# EAGLE schematic armBandShield (EAGLE 9.3.0)
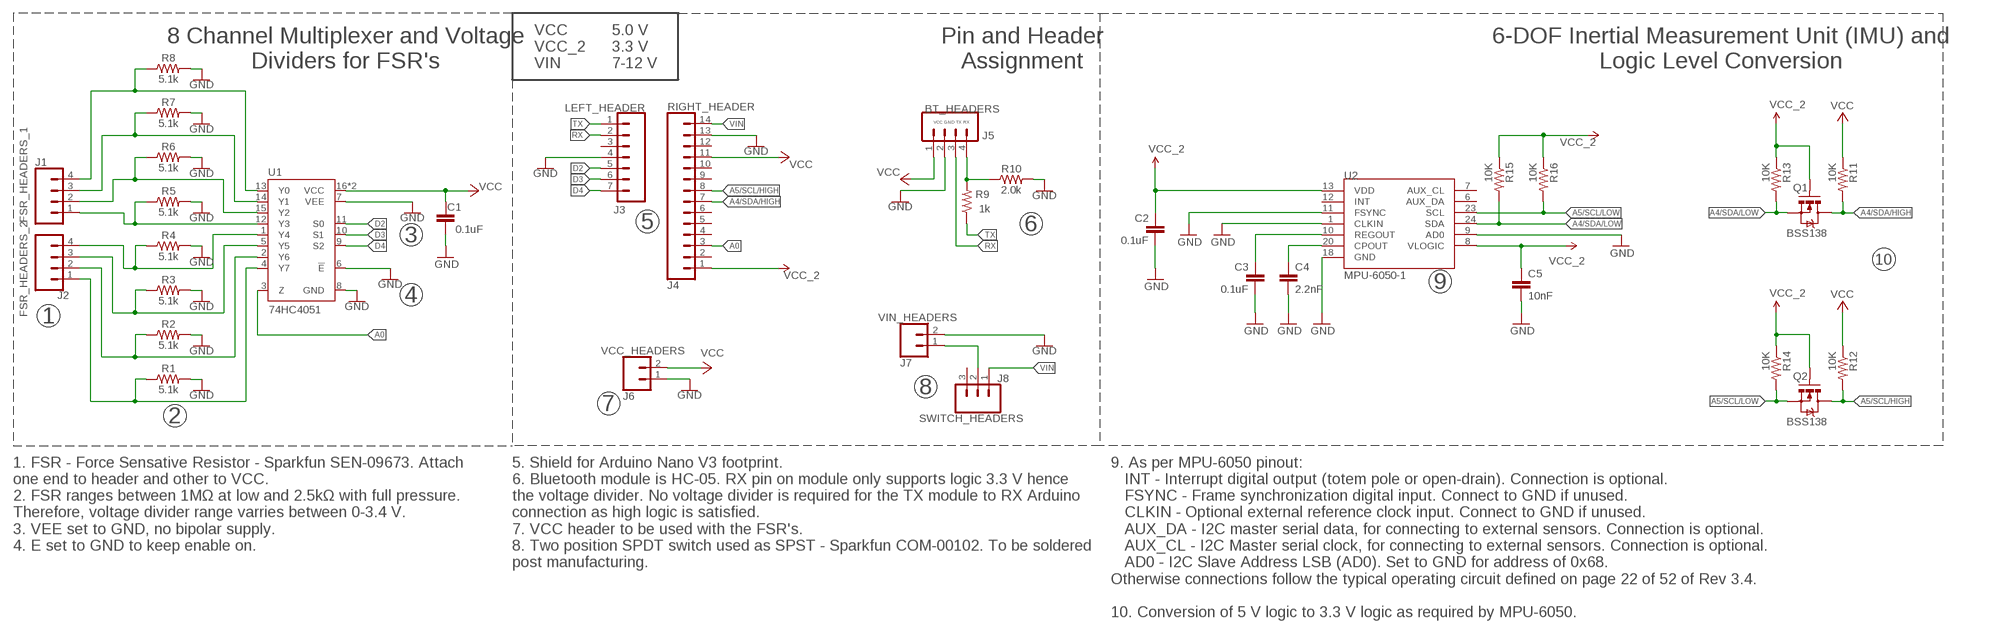
[diagram p0: schematic, sheet 1]

## Parts
74HC4051  U1  74HC4051BQ  [DHVQFN-16-2.5X3.5MM]
BT_HEADERS  J5  CONN_04  [1X04]
C1  0.1uF  0.1UF-25V(+80/-20%)(0603)  [0603-CAP]
C2  0.1uF  0.1UF-25V(+80/-20%)(0603)  [0603-CAP]
C3  0.1uF  0.1UF-25V(+80/-20%)(0603)  [0603-CAP]
C4  2.2nF  2.2NF/2200PF-0603-50V-10%  [0603]
C5  10nF  10NF-0603-50V-10%  [0603]
J1  FSR_HEADERS_1  CONN_04  [1X04]
J2  FSR_HEADERS_2  CONN_04  [1X04]
LEFT_HEADER  J3  CONN_07  [1X07]
Q1  BSS138  MOSFET-NCHANNELSMD  [SOT23-3]
Q2  BSS138  MOSFET-NCHANNELSMD  [SOT23-3]
R1  5.1k  5.1KOHM5.1KOHM-0603-1/10W-1%  [0603]
R2  5.1k  5.1KOHM5.1KOHM-0603-1/10W-1%  [0603]
R3  5.1k  5.1KOHM5.1KOHM-0603-1/10W-1%  [0603]
R4  5.1k  5.1KOHM5.1KOHM-0603-1/10W-1%  [0603]
R5  5.1k  5.1KOHM5.1KOHM-0603-1/10W-1%  [0603]
R6  5.1k  5.1KOHM5.1KOHM-0603-1/10W-1%  [0603]
R7  5.1k  5.1KOHM5.1KOHM-0603-1/10W-1%  [0603]
R8  5.1k  5.1KOHM5.1KOHM-0603-1/10W-1%  [0603]
R9  1k  1KOHM-0603-1/10W-1%  [0603]
R10  2.0k  2.0KOHM-0603-1/10W-5%  [0603]
R11  10K  RESISTOR0603-RES  [0603-RES]
R12  10K  RESISTOR0603-RES  [0603-RES]
R13  10K  RESISTOR0603-RES  [0603-RES]
R14  10K  RESISTOR0603-RES  [0603-RES]
R15  10K  10KOHM-1/10W-1%(0603)0603  [0603-RES]
R16  10K  10KOHM-1/10W-1%(0603)0603  [0603-RES]
RIGHT_HEADER  J4  CONN_14  [1X14]
SWITCH_HEADERS  J8  CONN_03  [1X03]
U2  MPU-6050-1  [QFN-24-4MM2]
VCC_HEADERS  J6  CONN_02PTH3  [1X02_LONGPADS]
VIN_HEADERS  J7  CONN_02PTH3  [1X02_LONGPADS]

## Nets
A0: 74HC4051.3(Z) RIGHT_HEADER.3
A4/SDA/HIGH: Q1.3(D) R11.2 RIGHT_HEADER.7
A4/SDA/LOW: Q1.2(S) R13.2 R15.2 U2.24(SDA)
A5/SCL/HIGH: Q2.3(D) R12.2 RIGHT_HEADER.8
A5/SCL/LOW: Q2.2(S) R14.2 R16.2 U2.23(SCL)
D2: 74HC4051.11(S0) LEFT_HEADER.5
D3: 74HC4051.10(S1) LEFT_HEADER.6
D4: 74HC4051.9(S2) LEFT_HEADER.7
FSR1: 74HC4051.4(Y7) J2.1 R1.1
FSR2: 74HC4051.2(Y6) J2.2 R2.1
FSR3: 74HC4051.5(Y5) J2.3 R3.1
FSR4: 74HC4051.1(Y4) J2.4 R4.1
FSR5: 74HC4051.12(Y3) J1.1 R5.1
FSR6: 74HC4051.15(Y2) J1.2 R6.1
FSR7: 74HC4051.14(Y1) J1.3 R7.1
FSR8: 74HC4051.13(Y0) J1.4 R8.1
GND [Pads]: 74HC4051.6(!E!) 74HC4051.7(VEE) 74HC4051.8(GND) BT_HEADERS.2 C1.2 C2.2 C3.2 C4.2 C5.2 LEFT_HEADER.4 R1.2 R2.2 R3.2 R4.2 R5.2 R6.2 R7.2 R8.2 R10.2 RIGHT_HEADER.13 U2.1(CLKIN) U2.9(AD0) U2.11(FSYNC) U2.18(GND) VCC_HEADERS.1 VIN_HEADERS.2
N$1: SWITCH_HEADERS.2 VIN_HEADERS.1
N$3: C4.1 U2.20(CPOUT)
N$5: C3.1 U2.10(REGOUT)
N$7: BT_HEADERS.4 R9.2 R10.1
RX: BT_HEADERS.3 LEFT_HEADER.2
TX: LEFT_HEADER.1 R9.1
VCC: 74HC4051.16(VCC) 74HC4051.EP(VCC) BT_HEADERS.1 C1.1 R11.1 R12.1 RIGHT_HEADER.11 VCC_HEADERS.2
VCC_2: C2.1 C5.1 Q1.1(G) Q2.1(G) R13.1 R14.1 R15.1 R16.1 RIGHT_HEADER.1 U2.8(VLOGIC) U2.13(VDD)
VIN: RIGHT_HEADER.14 SWITCH_HEADERS.1
Unconnected: LEFT_HEADER.3 RIGHT_HEADER.2 RIGHT_HEADER.4 RIGHT_HEADER.5 RIGHT_HEADER.6 RIGHT_HEADER.9 RIGHT_HEADER.10 RIGHT_HEADER.12 SWITCH_HEADERS.3 U2.6(AUX_DA) U2.7(AUX_CL) U2.12(INT)

## Notes on the sheet
- VCC
  VCC_2
  VIN
- 5.0 V
  3.3 V
  7-12 V
- 8 Channel Multiplexer and Voltage
  Dividers for FSR's
- Pin and Header
  Assignment
- 6-DOF Inertial Measurement Unit (IMU) and
  Logic Level Conversion
- VCC GND TX RX
- 5 | 6
- 3
- 10
- 9
- 4
- 1
- 8
- 7
- 2
- 1. FSR - Force Sensative Resistor - Sparkfun SEN-09673. Attach 
  one end to header and other to VCC.
  2. FSR ranges between 1MΩ at low and 2.5kΩ with full pressure. 
  Therefore, voltage divider range varries between 0-3.4 V. 
  3. VEE set to GND, no bipolar supply. 
  4. E set to GND to keep enable on.
- 5. Shield for Arduino Nano V3 footprint.
  6. Bluetooth module is HC-05. RX pin on module only supports logic 3.3 V hence 
  the voltage divider. No voltage divider is required for the TX module to RX Arduino
  connection as high logic is satisfied. 
  7. VCC header to be used with the FSR's.
  8. Two position SPDT switch used as SPST - Sparkfun COM-00102. To be soldered
  post manufacturing.
- 9. As per MPU-6050 pinout:
     INT - Interrupt digital output (totem pole or open-drain). Connection is optional.
     FSYNC - Frame synchronization digital input. Connect to GND if unused.
     CLKIN - Optional external reference clock input. Connect to GND if unused.
     AUX_DA - I2C master serial data, for connecting to external sensors. Connection is optional.
     AUX_CL - I2C Master serial clock, for connecting to external sensors. Connection is optional.
     AD0 - I2C Slave Address LSB (AD0). Set to GND for address of 0x68.
  Otherwise connections follow the typical operating circuit defined on page 22 of 52 of Rev 3.4.
  
  10. Conversion of 5 V logic to 3.3 V logic as required by MPU-6050.

## Library data of the parts
74HC4051 = SparkFun-IC-Logic:74*4051: NXP 74HC4051 8-Channel Analog Multiplexer/Demultiplexer The 74HC4051; 74HCT4051 is a single-pole octal-throw analog switch (SP8T) suitable for use in analog or digital 8:1 multiplexer/demultiplexer applications. The switch features three digital select inputs (S0, S1 and S2), eight independent inputs/outputs (Yn), a common input/output (Z) and a digital enable input (E). When E is HIGH, the switches are turned off. Inputs include clamp diodes. This enables the use of current limiting resistors to interface inputs to voltages in excess of VCC. Datasheet <http://www.nxp.com/documents/data_sheet/74HC_HCT4051.pdf>; PROD_ID: IC-13334
BT_HEADERS J1 J2 = SparkFun-Connectors:CONN_04: Multi connection point. Often used as Generic Header-pin footprint for 0.1 inch spaced/style header connections On any of the 0.1 inch spaced packages, you can populate with these: Break Away Headers - Straight <https://www.sparkfun.com/products/116> (PRT-00116) Break Away Male Headers - Right Angle <https://www.sparkfun.com/products/553> (PRT-00553) Female Headers <https://www.sparkfun.com/products/115> (PRT-00115) Break Away Headers - Machine Pin <https://www.sparkfun.com/products/117> (PRT-00117) Break Away Female Headers - Swiss Machine Pin <https://www.sparkfun.com/products/743> (PRT-00743) For SCREWTERMINALS and SPRING TERMINALS visit here: Screw Terimnals on SparkFun.com <https://www.sparkfun.com/search/results?term=Screw+Terminals> (5mm/3.5mm/2.54mm spacing) This device is also useful as a general connection point to wire up your design to another part of your project. Our various solder wires solder well into these plated through hole pads. Hook-Up Wire - Assortment (Stranded, 22 AWG) <https://www.sparkfun.com/products/11375> (PRT-11375) Hook-Up Wire - Assortment (Solid Core, 22 AWG) <https://www.sparkfun.com/products/11367> (PRT-11367) View the entire wire category on our website here <https://www.sparkfun.com/categories/141> Special notes: Molex polarized connector foot print use with SKU : PRT-08231 with associated crimp pins and housings. 1MM SMD Version SKU: PRT-10208; PROD_ID: CONN-09696
C1-C3 = SparkFun-Capacitors:0.1UF-25V(+80/-20%)(0603): CAP-00810 Ceramic Standard decoupling cap; PROD_ID: CAP-00810
C4 = SparkFun-Capacitors:2.2NF/2200PF: 2.2nF/2,200pF ceramic capacitors A capacitor is a passive two-terminal electrical component used to store electrical energy temporarily in an electric field.; PROD_ID: CAP-07877
C5 = SparkFun-Capacitors:10NF: 0.01uF/10nF/10,000pF ceramic capacitors A capacitor is a passive two-terminal electrical component used to store electrical energy temporarily in an electric field. CAP-09321; PROD_ID: CAP-00867
LEFT_HEADER = SparkFun-Connectors:CONN_07: Multi connection point. Often used as Generic Header-pin footprint for 0.1 inch spaced/style header connections On any of the 0.1 inch spaced packages, you can populate with these: Break Away Headers - Straight <https://www.sparkfun.com/products/116> (PRT-00116) Break Away Male Headers - Right Angle <https://www.sparkfun.com/products/553> (PRT-00553) Female Headers <https://www.sparkfun.com/products/115> (PRT-00115) Break Away Headers - Machine Pin <https://www.sparkfun.com/products/117> (PRT-00117) Break Away Female Headers - Swiss Machine Pin <https://www.sparkfun.com/products/743> (PRT-00743) For SCREWTERMINALS and SPRING TERMINALS visit here: Screw Terimnals on SparkFun.com <https://www.sparkfun.com/search/results?term=Screw+Terminals> (5mm/3.5mm/2.54mm spacing) This device is also useful as a general connection point to wire up your design to another part of your project. Our various solder wires solder well into these plated through hole pads. Hook-Up Wire - Assortment (Stranded, 22 AWG) <https://www.sparkfun.com/products/11375> (PRT-11375) Hook-Up Wire - Assortment (Solid Core, 22 AWG) <https://www.sparkfun.com/products/11367> (PRT-11367) View the entire wire category on our website here <https://www.sparkfun.com/categories/141> Special notes: Molex polarized connector foot print use with SKU : PRT-08231 with associated crimp pins and housings. 1MM SMD Version SKU: PRT-10208 NOTES ON THE VARIANTS LOCK and LOCK_LONGPADS... This footprint was designed to help hold the alignment of a through-hole component (i.e. 6-pin header) while soldering it into place. You may notice that each hole has been shifted either up or down by 0.005 of an inch from it's more standard position (which is a perfectly straight line). This slight alteration caused the pins (the squares in the middle) to touch the edges of the holes. Because they are alternating, it causes a "brace" to hold the component in place. 0.005 has proven to be the perfect amount of "off-center" position when using our standard breakaway headers. Although looks a little odd when you look at the bare footprint, once you have a header in there, the alteration is very hard to notice. Also,if you push a header all the way into place, it is covered up entirely on the bottom side.
Q1 Q2 = SparkFun:MOSFET-NCHANNEL
R1-R8 = SparkFun-Resistors:5.1KOHM; PROD_ID: RES-12083
R9 = SparkFun-Resistors:1KOHM: 1kΩ resistor A resistor is a passive two-terminal electrical component that implements electrical resistance as a circuit element. Resistors act to reduce current flow, and, at the same time, act to lower voltage levels within circuits. - Wikipedia; PROD_ID: RES-07856
R10 = SparkFun-Resistors:2.0KOHM: 2kΩ resistor A resistor is a passive two-terminal electrical component that implements electrical resistance as a circuit element. Resistors act to reduce current flow, and, at the same time, act to lower voltage levels within circuits. - Wikipedia; PROD_ID: RES-08296
R11-R14 = SparkFun:RESISTOR: Resistor Basic schematic elements and footprints for 0603, 1206, and PTH resistors.
R15 R16 = SparkFun-Resistors:10KOHM-1/10W-1%(0603): RES-00824; PROD_ID: RES-00824
RIGHT_HEADER = SparkFun-Connectors:CONN_14: Multi connection point. Often used as Generic Header-pin footprint for 0.1 inch spaced/style header connections On any of the 0.1 inch spaced packages, you can populate with these: Break Away Headers - Straight <https://www.sparkfun.com/products/116> (PRT-00116) Break Away Male Headers - Right Angle <https://www.sparkfun.com/products/553> (PRT-00553) Female Headers <https://www.sparkfun.com/products/115> (PRT-00115) Break Away Headers - Machine Pin <https://www.sparkfun.com/products/117> (PRT-00117) Break Away Female Headers - Swiss Machine Pin <https://www.sparkfun.com/products/743> (PRT-00743) For SCREWTERMINALS and SPRING TERMINALS visit here: Screw Terimnals on SparkFun.com <https://www.sparkfun.com/search/results?term=Screw+Terminals> (5mm/3.5mm/2.54mm spacing) This device is also useful as a general connection point to wire up your design to another part of your project. Our various solder wires solder well into these plated through hole pads. Hook-Up Wire - Assortment (Stranded, 22 AWG) <https://www.sparkfun.com/products/11375> (PRT-11375) Hook-Up Wire - Assortment (Solid Core, 22 AWG) <https://www.sparkfun.com/products/11367> (PRT-11367) View the entire wire category on our website here <https://www.sparkfun.com/categories/141> Special notes: Molex polarized connector foot print use with SKU : PRT-08231 with associated crimp pins and housings. 1MM SMD Version SKU: PRT-10208 NOTES ON THE VARIANTS LOCK and LOCK_LONGPADS... This footprint was designed to help hold the alignment of a through-hole component (i.e. 6-pin header) while soldering it into place. You may notice that each hole has been shifted either up or down by 0.005 of an inch from it's more standard position (which is a perfectly straight line). This slight alteration caused the pins (the squares in the middle) to touch the edges of the holes. Because they are alternating, it causes a "brace" to hold the component in place. 0.005 has proven to be the perfect amount of "off-center" position when using our standard breakaway headers. Although looks a little odd when you look at the bare footprint, once you have a header in there, the alteration is very hard to notice. Also,if you push a header all the way into place, it is covered up entirely on the bottom side.
SWITCH_HEADERS = SparkFun-Connectors:CONN_03: Multi connection point. Often used as Generic Header-pin footprint for 0.1 inch spaced/style header connections On any of the 0.1 inch spaced packages, you can populate with these: Break Away Headers - Straight <https://www.sparkfun.com/products/116> (PRT-00116) Break Away Male Headers - Right Angle <https://www.sparkfun.com/products/553> (PRT-00553) Female Headers <https://www.sparkfun.com/products/115> (PRT-00115) Break Away Headers - Machine Pin <https://www.sparkfun.com/products/117> (PRT-00117) Break Away Female Headers - Swiss Machine Pin <https://www.sparkfun.com/products/743> (PRT-00743) Stackable Header - 3 Pin (Female, 0.1") <https://www.sparkfun.com/products/13875> (PRT-13875) For SCREWTERMINALS and SPRING TERMINALS visit here: Screw Terimnals on SparkFun.com <https://www.sparkfun.com/search/results?term=Screw+Terminals> (5mm/3.5mm/2.54mm spacing) This device is also useful as a general connection point to wire up your design to another part of your project. Our various solder wires solder well into these plated through hole pads. Hook-Up Wire - Assortment (Stranded, 22 AWG) <https://www.sparkfun.com/products/11375> (PRT-11375) Hook-Up Wire - Assortment (Solid Core, 22 AWG) <https://www.sparkfun.com/products/11367> (PRT-11367) View the entire wire category on our website here <https://www.sparkfun.com/categories/141> Special notes: Molex polarized connector foot print use with SKU : PRT-08232 with associated crimp pins and housings.; PROD_ID: XXX-00000; VALUE: 455-1750-1-ND
U2 = Testing:MPU-6050
VCC_HEADERS VIN_HEADERS = SparkFun-Connectors:CONN_02: Multi connection point. Often used as Generic Header-pin footprint for 0.1 inch spaced/style header connections On any of the 0.1 inch spaced packages, you can populate with these: Break Away Headers - Straight <https://www.sparkfun.com/products/116> (PRT-00116) Break Away Male Headers - Right Angle <https://www.sparkfun.com/products/553> (PRT-00553) Female Headers <https://www.sparkfun.com/products/115> (PRT-00115) Break Away Headers - Machine Pin <https://www.sparkfun.com/products/117> (PRT-00117) Break Away Female Headers - Swiss Machine Pin <https://www.sparkfun.com/products/743> (PRT-00743) For SCREWTERMINALS and SPRING TERMINALS visit here: Screw Terimnals on SparkFun.com <https://www.sparkfun.com/search/results?term=Screw+Terminals> (5mm/3.5mm/2.54mm spacing) This device is also useful as a general connection point to wire up your design to another part of your project. Our various solder wires solder well into these plated through hole pads. Hook-Up Wire - Assortment (Stranded, 22 AWG) <https://www.sparkfun.com/products/11375> (PRT-11375) Hook-Up Wire - Assortment (Solid Core, 22 AWG) <https://www.sparkfun.com/products/11367> (PRT-11367) View the entire wire category on our website here <https://www.sparkfun.com/categories/141> Special notes: Molex polarized connector foot print use with: PRT-08233 with associated crimp pins and housings. 2.54_SCREWTERM for use with PRT-10571. 3.5mm Screw Terminal footprints for PRT-08084 5mm Screw Terminal footprints for use with PRT-08432

## Net classes
0 default: width 0.178 mm, drill 0.508 mm, clearance 0.229 mm
1 Pads: width 0.254 mm, clearance 0.203 mm
2 PWR: width 0.356 mm, drill 0.508 mm, clearance 0.229 mm